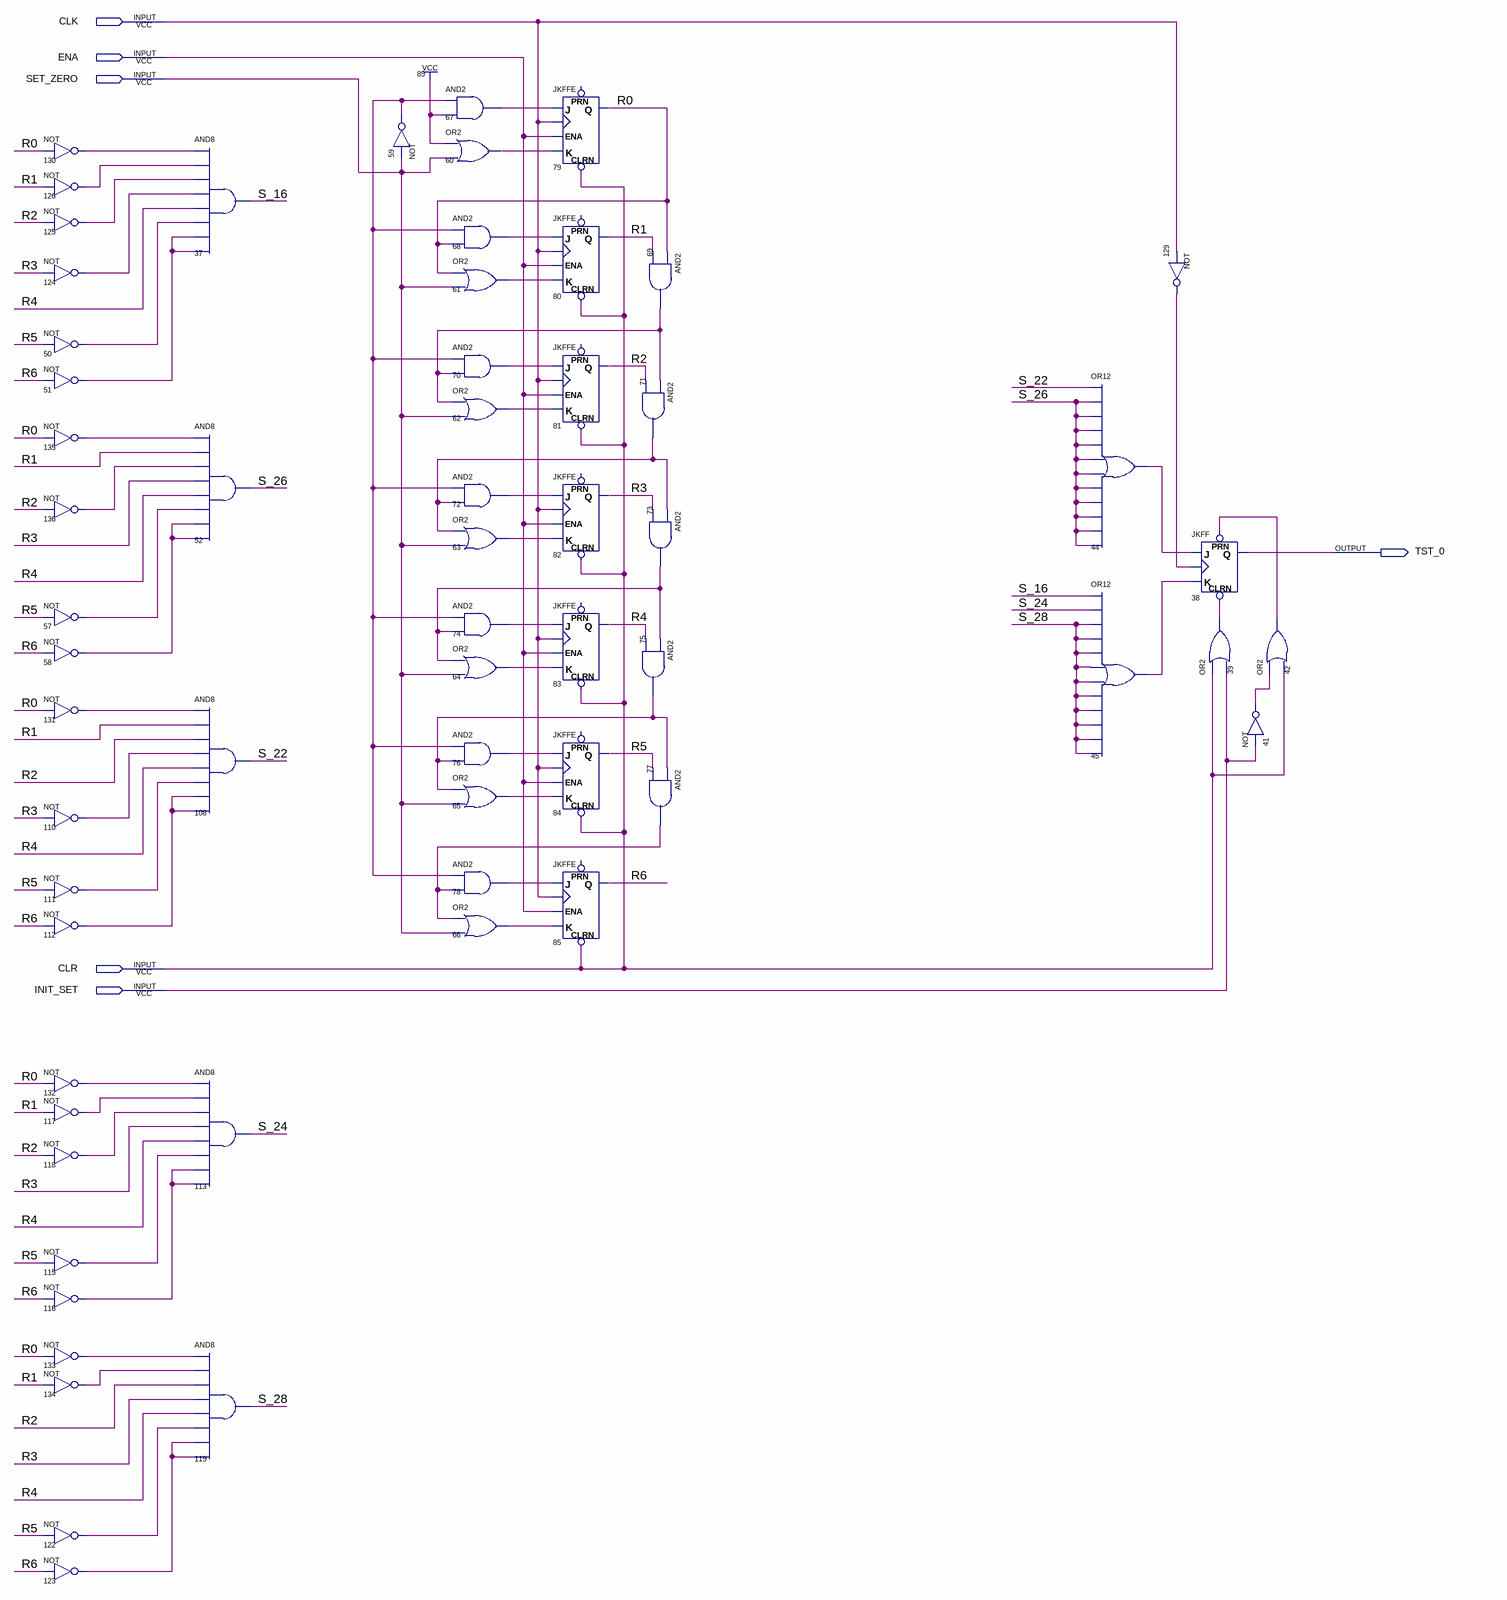
[diagram p0: schematic sheet]
// Quartus schematic test_seq.bdf as structural Verilog: 62 symbols, 6 pins
module test_seq (
  input  CLK,
  input  ENA,
  input  SET_ZERO,
  input  CLR,
  input  INIT_SET,
  output TST_0
);

  wire n39_out, n41_out, n42_out, n44_out, n45_out, n50_out, n51_out, n57_out, n58_out, n59_out, n60_out,
       n61_out, n62_out, n63_out, n64_out, n65_out, n66_out, n67_out, n68_out, n69_out, n70_out, n71_out,
       n72_out, n73_out, n74_out, n75_out, n76_out, n77_out, n78_out, n110_out, n111_out, n112_out, n115_out,
       n116_out, n117_out, n118_out, n122_out, n123_out, n124_out, n125_out, n126_out, n129_out, n130_out,
       n131_out, n132_out, n133_out, n134_out, n135_out, n136_out, R0, R1, R2, R3, R4, R5, R6, S_16, S_22,
       S_24, S_26, S_28;

  not u_130 (n130_out, R0);
  not u_126 (n126_out, R1);
  not u_125 (n125_out, R2);
  not u_124 (n124_out, R3);
  not u_50 (n50_out, R5);
  not u_51 (n51_out, R6);
  not u_135 (n135_out, R0);
  not u_136 (n136_out, R2);
  not u_57 (n57_out, R5);
  not u_58 (n58_out, R6);
  not u_131 (n131_out, R0);
  not u_110 (n110_out, R3);
  not u_111 (n111_out, R5);
  not u_112 (n112_out, R6);
  not u_132 (n132_out, R0);
  not u_117 (n117_out, R1);
  not u_118 (n118_out, R2);
  not u_115 (n115_out, R5);
  not u_116 (n116_out, R6);
  not u_133 (n133_out, R0);
  not u_134 (n134_out, R1);
  not u_122 (n122_out, R5);
  not u_123 (n123_out, R6);
  and u_37 (S_16, n130_out, n126_out, n125_out, n124_out, R4, n50_out, n51_out, n51_out);
  and u_52 (S_26, n135_out, R1, n136_out, R3, R4, n57_out, n58_out, n58_out);
  and u_108 (S_22, n131_out, R1, R2, n110_out, R4, n111_out, n112_out, n112_out);
  and u_113 (S_24, n132_out, n117_out, n118_out, R3, R4, n115_out, n116_out, n116_out);
  and u_119 (S_28, n133_out, n134_out, R2, R3, R4, n122_out, n123_out, n123_out);
  not u_59 (n59_out, SET_ZERO);
  and u_67 (n67_out, n59_out, 1'b1);
  or u_60 (n60_out, 1'b1, SET_ZERO);
  and u_68 (n68_out, n59_out, R0);
  or u_61 (n61_out, R0, SET_ZERO);
  and u_70 (n70_out, n59_out, n69_out);
  or u_62 (n62_out, n69_out, SET_ZERO);
  and u_72 (n72_out, n59_out, n71_out);
  or u_63 (n63_out, n71_out, SET_ZERO);
  and u_74 (n74_out, n59_out, n73_out);
  or u_64 (n64_out, n73_out, SET_ZERO);
  and u_76 (n76_out, n59_out, n75_out);
  or u_65 (n65_out, n75_out, SET_ZERO);
  and u_78 (n78_out, n59_out, n77_out);
  or u_66 (n66_out, n77_out, SET_ZERO);
  JKFFE u_79 (.J(n67_out), .CLK(CLK), .CLRN(CLR), .K(n60_out), .ENA(ENA), .Q(R0));  // open: PRN
  JKFFE u_80 (.J(n68_out), .CLK(CLK), .CLRN(CLR), .K(n61_out), .ENA(ENA), .Q(R1));  // open: PRN
  JKFFE u_81 (.J(n70_out), .CLK(CLK), .CLRN(CLR), .K(n62_out), .ENA(ENA), .Q(R2));  // open: PRN
  JKFFE u_82 (.J(n72_out), .CLK(CLK), .CLRN(CLR), .K(n63_out), .ENA(ENA), .Q(R3));  // open: PRN
  JKFFE u_83 (.J(n74_out), .CLK(CLK), .CLRN(CLR), .K(n64_out), .ENA(ENA), .Q(R4));  // open: PRN
  JKFFE u_84 (.J(n76_out), .CLK(CLK), .CLRN(CLR), .K(n65_out), .ENA(ENA), .Q(R5));  // open: PRN
  JKFFE u_85 (.J(n78_out), .CLK(CLK), .CLRN(CLR), .K(n66_out), .ENA(ENA), .Q(R6));  // open: PRN
  and u_69 (n69_out, R0, R1);
  and u_71 (n71_out, n69_out, R2);
  and u_73 (n73_out, n71_out, R3);
  and u_75 (n75_out, n73_out, R4);
  and u_77 (n77_out, n75_out, R5);
  or u_44 (n44_out, S_22, S_26, S_26, S_26, S_26, S_26, S_26, S_26, S_26, S_26, S_26, S_26);
  or u_45 (n45_out, S_16, S_24, S_28, S_28, S_28, S_28, S_28, S_28, S_28, S_28, S_28, S_28);
  not u_129 (n129_out, CLK);
  JKFF u_38 (.PRN(n42_out), .CLRN(n39_out), .K(n45_out), .J(n44_out), .CLK(n129_out), .Q(TST_0));
  or u_39 (n39_out, CLR, INIT_SET);
  or u_42 (n42_out, n41_out, CLR);
  not u_41 (n41_out, INIT_SET);
endmodule
